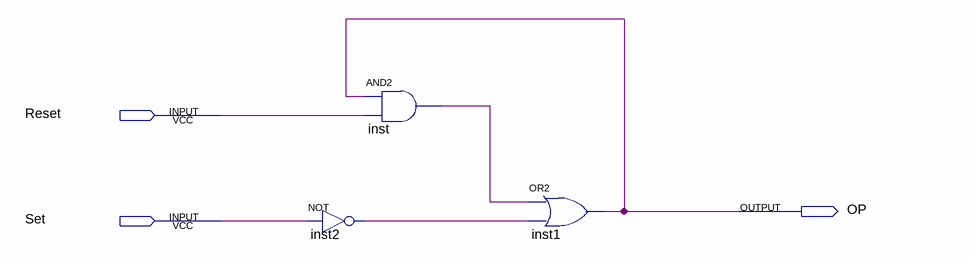
[diagram p0: schematic sheet]
// Quartus schematic ADDSUB.bdf as structural Verilog: 3 symbols, 3 pins
module ADDSUB (
  input  Reset,
  input  Set,
  output OP
);

  wire inst2_out, inst_out;

  and inst (inst_out, OP, Reset);
  not inst2 (inst2_out, Set);
  or inst1 (OP, inst_out, inst2_out);
endmodule
